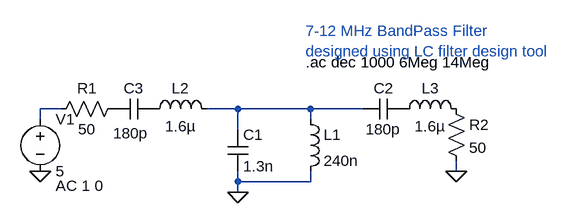
[diagram p0: schematic SDR Bandpass Filter 7-12MHz.asc]
SDR Bandpass Filter 7-12MHz.asc, the LTspice schematic file:
Version 4
SHEET 1 880 680
WIRE 128 192 96 192
WIRE 400 192 352 192
WIRE 512 192 400 192
WIRE 592 192 512 192
WIRE 96 208 96 192
WIRE 512 208 512 192
WIRE 400 224 400 192
WIRE 736 288 736 272
WIRE 400 304 400 288
WIRE 512 304 512 288
WIRE 512 304 400 304
WIRE 400 320 400 304
FLAG 96 288 0
FLAG 400 320 0
FLAG 736 288 0
SYMBOL cap 384 224 R0
SYMATTR InstName C1
SYMATTR Value 1.3n
SYMBOL cap 656 176 R90
WINDOW 0 0 32 VBottom 2
WINDOW 3 32 32 VTop 2
SYMATTR InstName C2
SYMATTR Value 180p
SYMBOL cap 272 176 R90
WINDOW 0 0 32 VBottom 2
WINDOW 3 38 37 VTop 2
SYMATTR InstName C3
SYMATTR Value 180p
SYMBOL ind 496 192 R0
SYMATTR InstName L1
SYMATTR Value 240n
SYMBOL voltage 96 192 R0
WINDOW 123 24 118 Left 2
SYMATTR Value2 AC 1 0
SYMATTR InstName V1
SYMATTR Value 5
SYMBOL res 224 176 R90
WINDOW 0 0 56 VBottom 2
WINDOW 3 32 56 VTop 2
SYMATTR InstName R1
SYMATTR Value 50
SYMBOL ind 256 208 R270
WINDOW 0 32 56 VTop 2
WINDOW 3 5 56 VBottom 2
SYMATTR InstName L2
SYMATTR Value 1.6µ
SYMBOL ind 640 208 R270
WINDOW 0 32 56 VTop 2
WINDOW 3 5 56 VBottom 2
SYMATTR InstName L3
SYMATTR Value 1.6µ
SYMBOL res 720 176 R0
SYMATTR InstName R2
SYMATTR Value 50
TEXT 504 120 Left 2 !.ac dec 1000 6Meg 14Meg
TEXT 504 72 Left 2 ;7-12 MHz BandPass Filter\ndesigned using LC filter design tool

The netlist it stands for:
* SDR Bandpass Filter 7-12MHz.asc
C1 N002 0 1.3n
C2 P001 N002 180p
C3 P002 P003 180p
L1 N002 0 240n
V1 N001 0 5 AC 1 0
R1 P003 N001 50
L2 P002 N002 1.6µ
L3 P001 P004 1.6µ
R2 P004 0 50
.ac dec 1000 6Meg 14Meg
* 7-12 MHz BandPass Filter
* designed using LC filter design tool
.backanno
.end